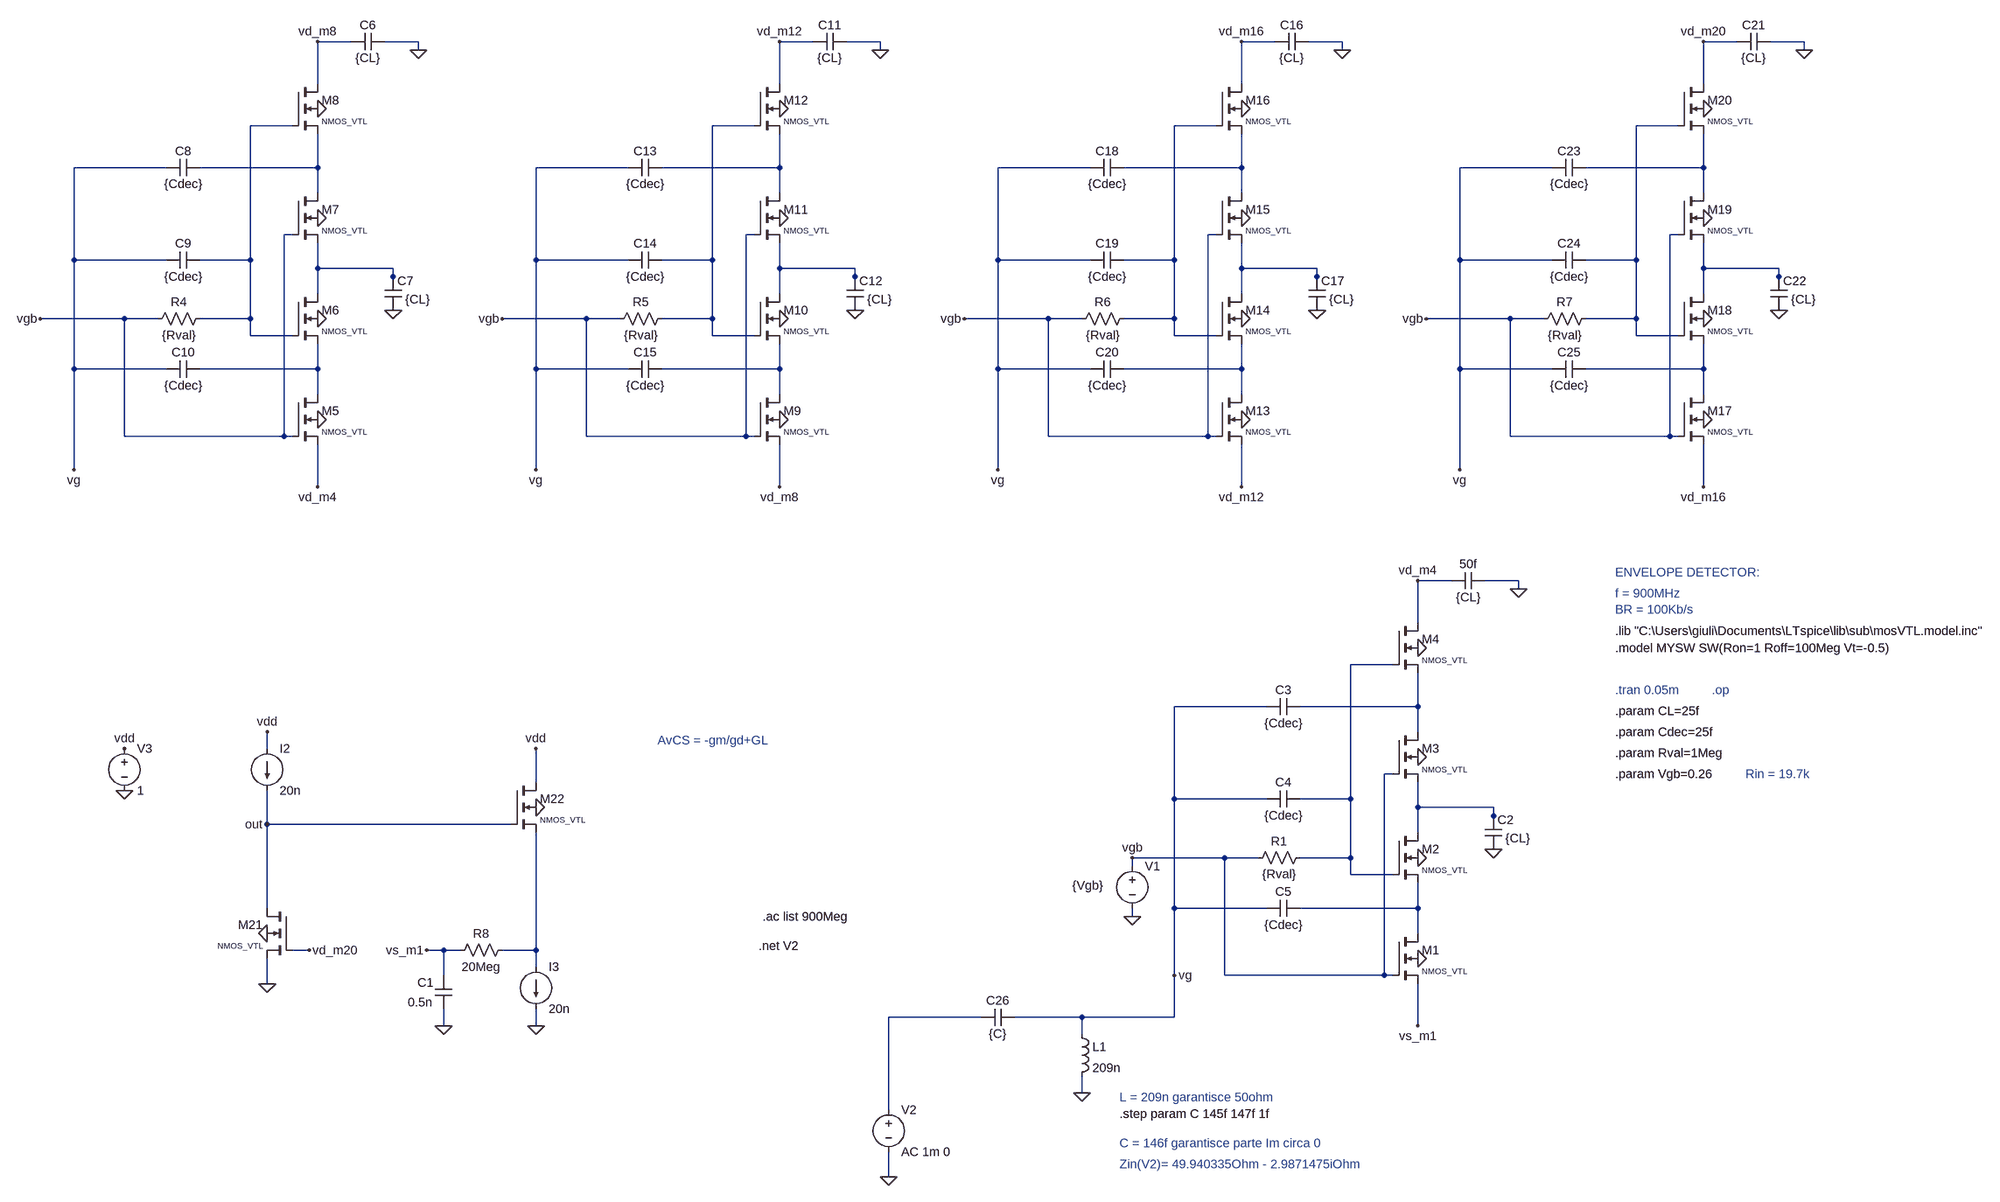
[diagram p0: schematic 7_envelope_multiple_mos_AMP_MN_C_design.asc]
7_envelope_multiple_mos_AMP_MN_C_design.asc, the LTspice schematic file:
Version 4
SHEET 1 2012 680
WIRE -1840 -1728 -1904 -1728
WIRE -1712 -1728 -1776 -1728
WIRE -960 -1728 -1024 -1728
WIRE -832 -1728 -896 -1728
WIRE -80 -1728 -144 -1728
WIRE 48 -1728 -16 -1728
WIRE 800 -1728 736 -1728
WIRE 928 -1728 864 -1728
WIRE -1712 -1712 -1712 -1728
WIRE -832 -1712 -832 -1728
WIRE 48 -1712 48 -1728
WIRE 928 -1712 928 -1728
WIRE -1904 -1648 -1904 -1728
WIRE -1024 -1648 -1024 -1728
WIRE -144 -1648 -144 -1728
WIRE 736 -1648 736 -1728
WIRE -1952 -1568 -2032 -1568
WIRE -1072 -1568 -1152 -1568
WIRE -192 -1568 -272 -1568
WIRE 688 -1568 608 -1568
WIRE -2192 -1488 -2368 -1488
WIRE -1904 -1488 -1904 -1552
WIRE -1904 -1488 -2128 -1488
WIRE -1312 -1488 -1488 -1488
WIRE -1024 -1488 -1024 -1552
WIRE -1024 -1488 -1248 -1488
WIRE -432 -1488 -608 -1488
WIRE -144 -1488 -144 -1552
WIRE -144 -1488 -368 -1488
WIRE 448 -1488 272 -1488
WIRE 736 -1488 736 -1552
WIRE 736 -1488 512 -1488
WIRE -1904 -1440 -1904 -1488
WIRE -1024 -1440 -1024 -1488
WIRE -144 -1440 -144 -1488
WIRE 736 -1440 736 -1488
WIRE -1952 -1360 -1968 -1360
WIRE -1072 -1360 -1088 -1360
WIRE -192 -1360 -208 -1360
WIRE 688 -1360 672 -1360
WIRE -2368 -1312 -2368 -1488
WIRE -2192 -1312 -2368 -1312
WIRE -2032 -1312 -2032 -1568
WIRE -2032 -1312 -2128 -1312
WIRE -1488 -1312 -1488 -1488
WIRE -1312 -1312 -1488 -1312
WIRE -1152 -1312 -1152 -1568
WIRE -1152 -1312 -1248 -1312
WIRE -608 -1312 -608 -1488
WIRE -432 -1312 -608 -1312
WIRE -272 -1312 -272 -1568
WIRE -272 -1312 -368 -1312
WIRE 272 -1312 272 -1488
WIRE 448 -1312 272 -1312
WIRE 608 -1312 608 -1568
WIRE 608 -1312 512 -1312
WIRE -1904 -1296 -1904 -1344
WIRE -1760 -1296 -1904 -1296
WIRE -1024 -1296 -1024 -1344
WIRE -880 -1296 -1024 -1296
WIRE -144 -1296 -144 -1344
WIRE 0 -1296 -144 -1296
WIRE 736 -1296 736 -1344
WIRE 880 -1296 736 -1296
WIRE -1760 -1280 -1760 -1296
WIRE -880 -1280 -880 -1296
WIRE 0 -1280 0 -1296
WIRE 880 -1280 880 -1296
WIRE -1760 -1264 -1760 -1280
WIRE -880 -1264 -880 -1280
WIRE 0 -1264 0 -1280
WIRE 880 -1264 880 -1280
WIRE -1904 -1248 -1904 -1296
WIRE -1024 -1248 -1024 -1296
WIRE -144 -1248 -144 -1296
WIRE 736 -1248 736 -1296
WIRE -2272 -1200 -2432 -1200
WIRE -2208 -1200 -2272 -1200
WIRE -2032 -1200 -2032 -1312
WIRE -2032 -1200 -2128 -1200
WIRE -1392 -1200 -1552 -1200
WIRE -1328 -1200 -1392 -1200
WIRE -1152 -1200 -1152 -1312
WIRE -1152 -1200 -1248 -1200
WIRE -512 -1200 -672 -1200
WIRE -448 -1200 -512 -1200
WIRE -272 -1200 -272 -1312
WIRE -272 -1200 -368 -1200
WIRE 368 -1200 208 -1200
WIRE 432 -1200 368 -1200
WIRE 608 -1200 608 -1312
WIRE 608 -1200 512 -1200
WIRE -2032 -1168 -2032 -1200
WIRE -1952 -1168 -2032 -1168
WIRE -1152 -1168 -1152 -1200
WIRE -1072 -1168 -1152 -1168
WIRE -272 -1168 -272 -1200
WIRE -192 -1168 -272 -1168
WIRE 608 -1168 608 -1200
WIRE 688 -1168 608 -1168
WIRE -2368 -1104 -2368 -1312
WIRE -2192 -1104 -2368 -1104
WIRE -1904 -1104 -1904 -1152
WIRE -1904 -1104 -2128 -1104
WIRE -1488 -1104 -1488 -1312
WIRE -1312 -1104 -1488 -1104
WIRE -1024 -1104 -1024 -1152
WIRE -1024 -1104 -1248 -1104
WIRE -608 -1104 -608 -1312
WIRE -432 -1104 -608 -1104
WIRE -144 -1104 -144 -1152
WIRE -144 -1104 -368 -1104
WIRE 272 -1104 272 -1312
WIRE 448 -1104 272 -1104
WIRE 736 -1104 736 -1152
WIRE 736 -1104 512 -1104
WIRE -1904 -1056 -1904 -1104
WIRE -1024 -1056 -1024 -1104
WIRE -144 -1056 -144 -1104
WIRE 736 -1056 736 -1104
WIRE -2272 -976 -2272 -1200
WIRE -1968 -976 -1968 -1360
WIRE -1968 -976 -2272 -976
WIRE -1952 -976 -1968 -976
WIRE -1392 -976 -1392 -1200
WIRE -1088 -976 -1088 -1360
WIRE -1088 -976 -1392 -976
WIRE -1072 -976 -1088 -976
WIRE -512 -976 -512 -1200
WIRE -208 -976 -208 -1360
WIRE -208 -976 -512 -976
WIRE -192 -976 -208 -976
WIRE 368 -976 368 -1200
WIRE 672 -976 672 -1360
WIRE 672 -976 368 -976
WIRE 688 -976 672 -976
WIRE -2368 -912 -2368 -1104
WIRE -1488 -912 -1488 -1104
WIRE -608 -912 -608 -1104
WIRE 272 -912 272 -1104
WIRE -1904 -880 -1904 -960
WIRE -1024 -880 -1024 -960
WIRE -144 -880 -144 -960
WIRE 736 -880 736 -960
WIRE 256 -576 192 -576
WIRE 384 -576 320 -576
WIRE 384 -560 384 -576
WIRE 192 -496 192 -576
WIRE 144 -416 64 -416
WIRE -96 -336 -272 -336
WIRE 192 -336 192 -400
WIRE 192 -336 -32 -336
WIRE 192 -288 192 -336
WIRE -2000 -256 -2000 -288
WIRE 144 -208 128 -208
WIRE -1488 -192 -1488 -256
WIRE -272 -160 -272 -336
WIRE -96 -160 -272 -160
WIRE 64 -160 64 -416
WIRE 64 -160 -32 -160
WIRE 192 -144 192 -192
WIRE 336 -144 192 -144
WIRE 336 -128 336 -144
WIRE -2000 -112 -2000 -176
WIRE -1536 -112 -2000 -112
WIRE 336 -112 336 -128
WIRE 192 -96 192 -144
WIRE -176 -48 -352 -48
WIRE -112 -48 -176 -48
WIRE 64 -48 64 -160
WIRE 64 -48 -32 -48
WIRE -352 -32 -352 -48
WIRE 64 -16 64 -48
WIRE 144 -16 64 -16
WIRE -2000 48 -2000 -112
WIRE -272 48 -272 -160
WIRE -96 48 -272 48
WIRE 192 48 192 0
WIRE 192 48 -32 48
WIRE -352 64 -352 48
WIRE 192 96 192 48
WIRE -1920 128 -1952 128
WIRE -1664 128 -1696 128
WIRE -1632 128 -1664 128
WIRE -1488 128 -1488 -96
WIRE -1488 128 -1552 128
WIRE -1488 160 -1488 128
WIRE -1664 176 -1664 128
WIRE -272 176 -272 48
WIRE -176 176 -176 -48
WIRE 128 176 128 -208
WIRE 128 176 -176 176
WIRE 144 176 128 176
WIRE -2000 192 -2000 144
WIRE -640 256 -816 256
WIRE -448 256 -576 256
WIRE -272 256 -272 176
WIRE -272 256 -448 256
WIRE -1664 272 -1664 240
WIRE -1488 272 -1488 240
WIRE 192 272 192 192
WIRE -448 288 -448 256
WIRE -448 400 -448 368
WIRE -816 432 -816 256
WIRE -816 560 -816 512
FLAG 192 -448 0
FLAG 192 -240 0
FLAG 192 -48 0
FLAG 192 144 0
FLAG 384 -560 0
FLAG 336 -64 0
FLAG -352 64 0
FLAG -1904 -1600 0
FLAG -1904 -1392 0
FLAG -1904 -1200 0
FLAG -1904 -1008 0
FLAG -1712 -1712 0
FLAG -1760 -1216 0
FLAG -1904 -1728 vd_m8
FLAG -2368 -912 vg
FLAG -1904 -880 vd_m4
FLAG -352 -48 vgb
FLAG -2432 -1200 vgb
FLAG -1024 -1600 0
FLAG -1024 -1392 0
FLAG -1024 -1200 0
FLAG -1024 -1008 0
FLAG -832 -1712 0
FLAG -880 -1216 0
FLAG -1024 -1728 vd_m12
FLAG -1488 -912 vg
FLAG -1024 -880 vd_m8
FLAG -1552 -1200 vgb
FLAG -144 -1600 0
FLAG -144 -1392 0
FLAG -144 -1200 0
FLAG -144 -1008 0
FLAG 48 -1712 0
FLAG 0 -1216 0
FLAG -144 -1728 vd_m16
FLAG -608 -912 vg
FLAG -144 -880 vd_m12
FLAG -672 -1200 vgb
FLAG 736 -1600 0
FLAG 736 -1392 0
FLAG 736 -1200 0
FLAG 736 -1008 0
FLAG 928 -1712 0
FLAG 880 -1216 0
FLAG 736 -1728 vd_m20
FLAG 272 -912 vg
FLAG 736 -880 vd_m16
FLAG 208 -1200 vgb
FLAG 192 -576 vd_m4
FLAG 192 272 vs_m1
FLAG -2000 192 0
FLAG -2000 96 0
FLAG -1488 -256 vdd
FLAG -2272 -176 0
FLAG -2272 -256 vdd
FLAG -1488 272 0
FLAG -1664 272 0
FLAG -1920 128 vd_m20
FLAG -1488 -144 0
FLAG -1696 128 vs_m1
FLAG -2000 -112 out
FLAG -2000 -288 vdd
FLAG -272 176 vg
FLAG -816 560 0
FLAG -448 400 0
SYMBOL nmos4 144 96 R0
WINDOW 3 56 72 Left 1
SYMATTR Value NMOS_VTL
SYMATTR InstName M1
SYMATTR Value2 l=50n w=150n
SYMBOL nmos4 144 -96 R0
WINDOW 3 56 72 Left 1
SYMATTR Value NMOS_VTL
SYMATTR InstName M2
SYMATTR Value2 l=50n w=150n
SYMBOL nmos4 144 -288 R0
WINDOW 3 56 72 Left 1
SYMATTR Value NMOS_VTL
SYMATTR InstName M3
SYMATTR Value2 l=50n w=150n
SYMBOL nmos4 144 -496 R0
WINDOW 3 56 72 Left 1
SYMATTR Value NMOS_VTL
SYMATTR InstName M4
SYMATTR Value2 l=50n w=150n
SYMBOL cap 320 -592 R90
WINDOW 0 0 32 VBottom 2
WINDOW 3 32 32 VTop 2
SYMATTR InstName 50f
SYMATTR Value {CL}
SYMBOL cap 320 -128 R0
WINDOW 3 39 43 Left 2
SYMATTR Value {CL}
SYMATTR InstName C2
SYMBOL cap -32 -352 R90
WINDOW 0 0 32 VBottom 2
WINDOW 3 32 32 VTop 2
SYMATTR InstName C3
SYMATTR Value {Cdec}
SYMBOL cap -32 -176 R90
WINDOW 0 0 32 VBottom 2
WINDOW 3 32 32 VTop 2
SYMATTR InstName C4
SYMATTR Value {Cdec}
SYMBOL cap -32 32 R90
WINDOW 0 0 32 VBottom 2
WINDOW 3 32 32 VTop 2
SYMATTR InstName C5
SYMATTR Value {Cdec}
SYMBOL res -16 -64 R90
WINDOW 0 0 56 VBottom 2
WINDOW 3 32 56 VTop 2
SYMATTR InstName R1
SYMATTR Value {Rval}
SYMBOL voltage -352 -48 R0
WINDOW 123 0 0 Left 0
WINDOW 39 0 0 Left 0
WINDOW 3 -114 53 Left 2
SYMATTR Value {Vgb}
SYMATTR InstName V1
SYMBOL nmos4 -1952 -1056 R0
WINDOW 3 56 72 Left 1
SYMATTR Value NMOS_VTL
SYMATTR InstName M5
SYMATTR Value2 l=50n w=150n
SYMBOL nmos4 -1952 -1248 R0
WINDOW 3 56 72 Left 1
SYMATTR Value NMOS_VTL
SYMATTR InstName M6
SYMATTR Value2 l=50n w=150n
SYMBOL nmos4 -1952 -1440 R0
WINDOW 3 56 72 Left 1
SYMATTR Value NMOS_VTL
SYMATTR InstName M7
SYMATTR Value2 l=50n w=150n
SYMBOL nmos4 -1952 -1648 R0
WINDOW 3 56 72 Left 1
SYMATTR Value NMOS_VTL
SYMATTR InstName M8
SYMATTR Value2 l=50n w=150n
SYMBOL cap -1776 -1744 R90
WINDOW 0 0 32 VBottom 2
WINDOW 3 32 32 VTop 2
SYMATTR InstName C6
SYMATTR Value {CL}
SYMBOL cap -1776 -1280 R0
WINDOW 3 39 43 Left 2
SYMATTR Value {CL}
SYMATTR InstName C7
SYMBOL cap -2128 -1504 R90
WINDOW 0 0 32 VBottom 2
WINDOW 3 32 32 VTop 2
SYMATTR InstName C8
SYMATTR Value {Cdec}
SYMBOL cap -2128 -1328 R90
WINDOW 0 0 32 VBottom 2
WINDOW 3 32 32 VTop 2
SYMATTR InstName C9
SYMATTR Value {Cdec}
SYMBOL cap -2128 -1120 R90
WINDOW 0 0 32 VBottom 2
WINDOW 3 32 32 VTop 2
SYMATTR InstName C10
SYMATTR Value {Cdec}
SYMBOL res -2112 -1216 R90
WINDOW 0 0 56 VBottom 2
WINDOW 3 32 56 VTop 2
SYMATTR InstName R4
SYMATTR Value {Rval}
SYMBOL nmos4 -1072 -1056 R0
WINDOW 3 56 72 Left 1
SYMATTR Value NMOS_VTL
SYMATTR InstName M9
SYMATTR Value2 l=50n w=150n
SYMBOL nmos4 -1072 -1248 R0
WINDOW 3 56 72 Left 1
SYMATTR Value NMOS_VTL
SYMATTR InstName M10
SYMATTR Value2 l=50n w=150n
SYMBOL nmos4 -1072 -1440 R0
WINDOW 3 56 72 Left 1
SYMATTR Value NMOS_VTL
SYMATTR InstName M11
SYMATTR Value2 l=50n w=150n
SYMBOL nmos4 -1072 -1648 R0
WINDOW 3 56 72 Left 1
SYMATTR Value NMOS_VTL
SYMATTR InstName M12
SYMATTR Value2 l=50n w=150n
SYMBOL cap -896 -1744 R90
WINDOW 0 0 32 VBottom 2
WINDOW 3 32 32 VTop 2
SYMATTR InstName C11
SYMATTR Value {CL}
SYMBOL cap -896 -1280 R0
WINDOW 3 39 43 Left 2
SYMATTR Value {CL}
SYMATTR InstName C12
SYMBOL cap -1248 -1504 R90
WINDOW 0 0 32 VBottom 2
WINDOW 3 32 32 VTop 2
SYMATTR InstName C13
SYMATTR Value {Cdec}
SYMBOL cap -1248 -1328 R90
WINDOW 0 0 32 VBottom 2
WINDOW 3 32 32 VTop 2
SYMATTR InstName C14
SYMATTR Value {Cdec}
SYMBOL cap -1248 -1120 R90
WINDOW 0 0 32 VBottom 2
WINDOW 3 32 32 VTop 2
SYMATTR InstName C15
SYMATTR Value {Cdec}
SYMBOL res -1232 -1216 R90
WINDOW 0 0 56 VBottom 2
WINDOW 3 32 56 VTop 2
SYMATTR InstName R5
SYMATTR Value {Rval}
SYMBOL nmos4 -192 -1056 R0
WINDOW 3 56 72 Left 1
SYMATTR Value NMOS_VTL
SYMATTR InstName M13
SYMATTR Value2 l=50n w=150n
SYMBOL nmos4 -192 -1248 R0
WINDOW 3 56 72 Left 1
SYMATTR Value NMOS_VTL
SYMATTR InstName M14
SYMATTR Value2 l=50n w=150n
SYMBOL nmos4 -192 -1440 R0
WINDOW 3 56 72 Left 1
SYMATTR Value NMOS_VTL
SYMATTR InstName M15
SYMATTR Value2 l=50n w=150n
SYMBOL nmos4 -192 -1648 R0
WINDOW 3 56 72 Left 1
SYMATTR Value NMOS_VTL
SYMATTR InstName M16
SYMATTR Value2 l=50n w=150n
SYMBOL cap -16 -1744 R90
WINDOW 0 0 32 VBottom 2
WINDOW 3 32 32 VTop 2
SYMATTR InstName C16
SYMATTR Value {CL}
SYMBOL cap -16 -1280 R0
WINDOW 3 39 43 Left 2
SYMATTR Value {CL}
SYMATTR InstName C17
SYMBOL cap -368 -1504 R90
WINDOW 0 0 32 VBottom 2
WINDOW 3 32 32 VTop 2
SYMATTR InstName C18
SYMATTR Value {Cdec}
SYMBOL cap -368 -1328 R90
WINDOW 0 0 32 VBottom 2
WINDOW 3 32 32 VTop 2
SYMATTR InstName C19
SYMATTR Value {Cdec}
SYMBOL cap -368 -1120 R90
WINDOW 0 0 32 VBottom 2
WINDOW 3 32 32 VTop 2
SYMATTR InstName C20
SYMATTR Value {Cdec}
SYMBOL res -352 -1216 R90
WINDOW 0 0 56 VBottom 2
WINDOW 3 32 56 VTop 2
SYMATTR InstName R6
SYMATTR Value {Rval}
SYMBOL nmos4 688 -1056 R0
WINDOW 3 56 72 Left 1
SYMATTR Value NMOS_VTL
SYMATTR InstName M17
SYMATTR Value2 l=50n w=150n
SYMBOL nmos4 688 -1248 R0
WINDOW 3 56 72 Left 1
SYMATTR Value NMOS_VTL
SYMATTR InstName M18
SYMATTR Value2 l=50n w=150n
SYMBOL nmos4 688 -1440 R0
WINDOW 3 56 72 Left 1
SYMATTR Value NMOS_VTL
SYMATTR InstName M19
SYMATTR Value2 l=50n w=150n
SYMBOL nmos4 688 -1648 R0
WINDOW 3 56 72 Left 1
SYMATTR Value NMOS_VTL
SYMATTR InstName M20
SYMATTR Value2 l=50n w=150n
SYMBOL cap 864 -1744 R90
WINDOW 0 0 32 VBottom 2
WINDOW 3 32 32 VTop 2
SYMATTR InstName C21
SYMATTR Value {CL}
SYMBOL cap 864 -1280 R0
WINDOW 3 39 43 Left 2
SYMATTR Value {CL}
SYMATTR InstName C22
SYMBOL cap 512 -1504 R90
WINDOW 0 0 32 VBottom 2
WINDOW 3 32 32 VTop 2
SYMATTR InstName C23
SYMATTR Value {Cdec}
SYMBOL cap 512 -1328 R90
WINDOW 0 0 32 VBottom 2
WINDOW 3 32 32 VTop 2
SYMATTR InstName C24
SYMATTR Value {Cdec}
SYMBOL cap 512 -1120 R90
WINDOW 0 0 32 VBottom 2
WINDOW 3 32 32 VTop 2
SYMATTR InstName C25
SYMATTR Value {Cdec}
SYMBOL res 528 -1216 R90
WINDOW 0 0 56 VBottom 2
WINDOW 3 32 56 VTop 2
SYMATTR InstName R7
SYMATTR Value {Rval}
SYMBOL nmos4 -1952 48 M0
WINDOW 3 56 72 Left 1
SYMATTR Value NMOS_VTL
SYMATTR InstName M21
SYMATTR Value2 l=50n w=70n
SYMBOL current -2000 -256 R0
WINDOW 123 0 0 Left 0
WINDOW 39 0 0 Left 0
SYMATTR InstName I2
SYMATTR Value 20n
SYMBOL nmos4 -1536 -192 R0
WINDOW 3 56 72 Left 1
SYMATTR Value NMOS_VTL
SYMATTR InstName M22
SYMATTR Value2 l=50n w=150n
SYMBOL voltage -2272 -272 R0
SYMATTR InstName V3
SYMATTR Value 1
SYMBOL current -1488 160 R0
WINDOW 123 0 0 Left 0
WINDOW 39 0 0 Left 0
SYMATTR InstName I3
SYMATTR Value 20n
SYMBOL res -1536 112 R90
WINDOW 0 0 56 VBottom 2
WINDOW 3 32 56 VTop 2
SYMATTR InstName R8
SYMATTR Value 20Meg
SYMBOL cap -1680 176 R0
WINDOW 0 -34 14 Left 2
WINDOW 3 -52 51 Left 2
SYMATTR InstName C1
SYMATTR Value 0.5n
SYMBOL voltage -816 416 R0
WINDOW 123 0 0 Left 0
WINDOW 39 0 0 Left 0
SYMATTR InstName V2
SYMATTR Value AC 1m 0
SYMBOL ind -464 272 R0
SYMATTR InstName L1
SYMATTR Value 209n
SYMBOL cap -576 240 R90
WINDOW 0 0 32 VBottom 2
WINDOW 3 32 32 VTop 2
SYMATTR InstName C26
SYMATTR Value {C}
TEXT 568 -552 Left 2 ;f = 900MHz\nBR = 100Kb/s
TEXT 568 -480 Left 2 !.lib "C:\\Users\\giuli\\Documents\\LTspice\\lib\\sub\\mosVTL.model.inc"
TEXT 568 -448 Left 2 !.model MYSW SW(Ron=1 Roff=100Meg Vt=-0.5)
TEXT 568 -368 Left 2 ;.tran 0.05m
TEXT 568 -328 Left 2 !.param CL=25f
TEXT 568 -288 Left 2 !.param Cdec=25f
TEXT 568 -248 Left 2 !.param Rval=1Meg
TEXT 568 -592 Left 2 ;ENVELOPE DETECTOR:
TEXT 752 -368 Left 2 ;.op
TEXT 568 -208 Left 2 !.param Vgb=0.26
TEXT -1256 -272 Left 2 ;AvCS = -gm/gd+GL
TEXT -1056 64 Left 2 !.ac list 900Meg
TEXT -1064 120 Left 2 !.net V2
TEXT 816 -208 Left 2 ;Rin = 19.7k
TEXT -376 440 Left 2 !.step param C 145f 147f 1f
TEXT -376 408 Left 2 ;L = 209n garantisce 50ohm
TEXT -376 536 Left 2 ;Zin(V2)= 49.940335Ohm - 2.9871475iOhm
TEXT -376 496 Left 2 ;C = 146f garantisce parte Im circa 0

The netlist it stands for:
* 7_envelope_multiple_mos_AMP_MN_C_design.asc
M1 N020 vgb vs_m1 0 NMOS_VTL l=50n w=150n
M2 N019 N017 N020 0 NMOS_VTL l=50n w=150n
M3 N018 vgb N019 0 NMOS_VTL l=50n w=150n
M4 vd_m4 N017 N018 0 NMOS_VTL l=50n w=150n
C§50f 0 vd_m4 {CL}
C2 N019 0 {CL}
C3 N018 vg {Cdec}
C4 N017 vg {Cdec}
C5 N020 vg {Cdec}
R1 N017 vgb {Rval}
V1 vgb 0 {Vgb}
M5 N013 vgb vd_m4 0 NMOS_VTL l=50n w=150n
M6 N009 N001 N013 0 NMOS_VTL l=50n w=150n
M7 N005 vgb N009 0 NMOS_VTL l=50n w=150n
M8 vd_m8 N001 N005 0 NMOS_VTL l=50n w=150n
C6 0 vd_m8 {CL}
C7 N009 0 {CL}
C8 N005 vg {Cdec}
C9 N001 vg {Cdec}
C10 N013 vg {Cdec}
R4 N001 vgb {Rval}
M9 N014 vgb vd_m8 0 NMOS_VTL l=50n w=150n
M10 N010 N002 N014 0 NMOS_VTL l=50n w=150n
M11 N006 vgb N010 0 NMOS_VTL l=50n w=150n
M12 vd_m12 N002 N006 0 NMOS_VTL l=50n w=150n
C11 0 vd_m12 {CL}
C12 N010 0 {CL}
C13 N006 vg {Cdec}
C14 N002 vg {Cdec}
C15 N014 vg {Cdec}
R5 N002 vgb {Rval}
M13 N015 vgb vd_m12 0 NMOS_VTL l=50n w=150n
M14 N011 N003 N015 0 NMOS_VTL l=50n w=150n
M15 N007 vgb N011 0 NMOS_VTL l=50n w=150n
M16 vd_m16 N003 N007 0 NMOS_VTL l=50n w=150n
C16 0 vd_m16 {CL}
C17 N011 0 {CL}
C18 N007 vg {Cdec}
C19 N003 vg {Cdec}
C20 N015 vg {Cdec}
R6 N003 vgb {Rval}
M17 N016 vgb vd_m16 0 NMOS_VTL l=50n w=150n
M18 N012 N004 N016 0 NMOS_VTL l=50n w=150n
M19 N008 vgb N012 0 NMOS_VTL l=50n w=150n
M20 vd_m20 N004 N008 0 NMOS_VTL l=50n w=150n
C21 0 vd_m20 {CL}
C22 N012 0 {CL}
C23 N008 vg {Cdec}
C24 N004 vg {Cdec}
C25 N016 vg {Cdec}
R7 N004 vgb {Rval}
M21 out vd_m20 0 0 NMOS_VTL l=50n w=70n
I2 vdd out 20n
M22 vdd out N021 0 NMOS_VTL l=50n w=150n
V3 vdd 0 1
I3 N021 0 20n
R8 N021 vs_m1 20Meg
C1 vs_m1 0 0.5n
V2 N022 0 AC 1m 0
L1 vg 0 209n
C26 vg N022 {C}
.model NMOS NMOS
.model PMOS PMOS
.lib standard.mos
* f = 900MHz
* BR = 100Kb/s
.lib "C:\Users\giuli\Documents\LTspice\lib\sub\mosVTL.model.inc"
.model MYSW SW(Ron=1 Roff=100Meg Vt=-0.5)
* .tran 0.05m
.param CL=25f
.param Cdec=25f
.param Rval=1Meg
* ENVELOPE DETECTOR:
* .op
.param Vgb=0.26
* AvCS = -gm/gd+GL
.ac list 900Meg
.net V2
* Rin = 19.7k
.step param C 145f 147f 1f
* L = 209n garantisce 50ohm
* Zin(V2)= 49.940335Ohm - 2.9871475iOhm
* C = 146f garantisce parte Im circa 0
.backanno
.end